# Altium project Kretsn_Brillz_4.PrjPcb
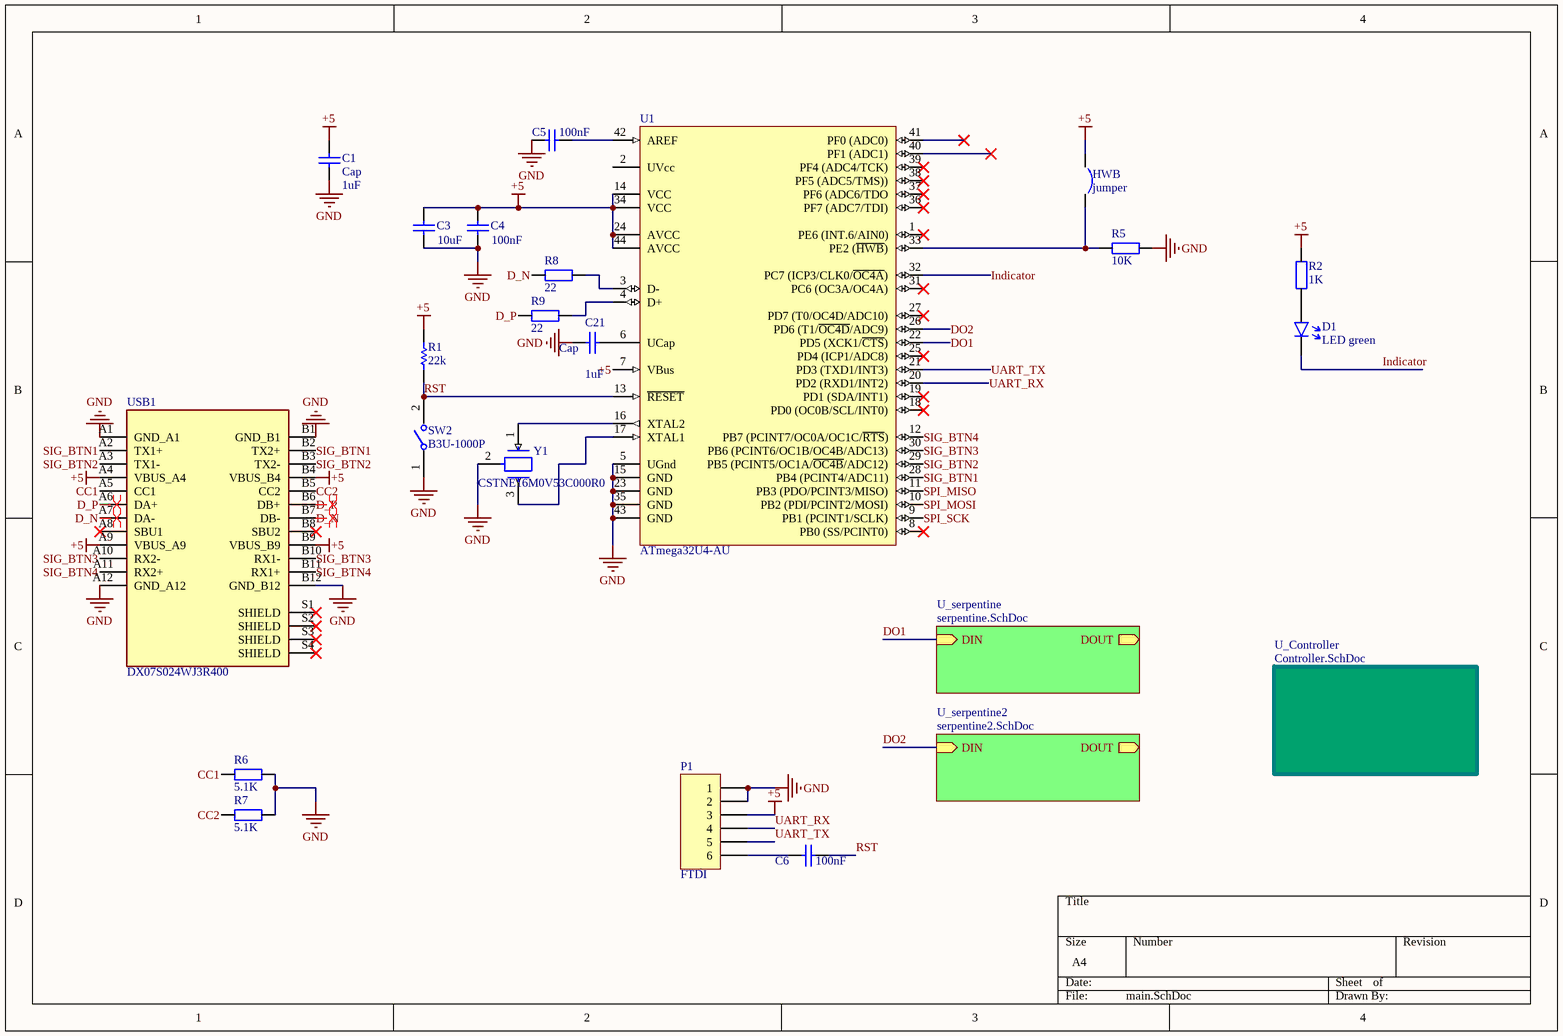
[diagram p0: main.SchDoc]
5 sheets, 142 parts. Net scope: hierarchical (ports join the sheet entries above them; power ports are global).
Board file: PCB1.PcbDoc
Sheets:
  main.SchDoc
    U_Controller = Controller.SchDoc
    U_serpentine = serpentine.SchDoc
      U_Column1 = Column.SchDoc
      U_Column2 = Column.SchDoc
      U_Column3 = Column.SchDoc
      U_Column4 = Column.SchDoc
      U_Column5 = Column.SchDoc
      U_Column6 = Column.SchDoc
      U_Column7 = Column.SchDoc
    U_serpentine2 = serpentine2.SchDoc
      U_Column8 = Column.SchDoc
      U_Column9 = Column.SchDoc
      U_Column10 = Column.SchDoc
      U_Column12 = Column.SchDoc
      U_Column13 = Column.SchDoc
      U_Column14 = Column.SchDoc
      U_Column15 = Column.SchDoc

## Sheet main.SchDoc
size A4; SheetNumber: 1; SheetTotal: 5

### Parts
C1  Cap  value 1uF  [6-0805_M]
C3  value 10uF  [6-0805_N]  (hidden comment: Cap)
C4  value 100nF  [6-0805_N]  (hidden comment: Cap)
C5  value 100nF  [6-0805_N]  (hidden comment: Cap)
C6  value 100nF  [6-0805_N]  (hidden comment: Cap)
C21  Cap  value 1uF  [6-0805_N]
D1  LED green  [LED0805]
HWB  jumper  [smd jumper]
P1  FTDI  [HDR1X6H]
R1  22k  [6-0805_N]
R2  1K  [RES0805]
R5  10K  [RES0805]
R6  5.1K  [RES0805]
R7  5.1K  [RES0805]
R8  22  [RES0805]
R9  22  [RES0805]
SW2  B3U-1000P  [FP-B3U-1000P-MFG]
U1  ATmega32U4-AU  [44ML_M]
USB1  DX07S024WJ3R400  [JAE_DX07S024WJ3R400]
Y1  CSTNE16M0V53C000R0  [FP-CSTNE16M0V53C000R0-MFG]

### Sub-sheets
U_Controller = Controller.SchDoc: no entries
U_serpentine = serpentine.SchDoc: DIN (in), DOUT (out)
U_serpentine2 = serpentine2.SchDoc: DIN (in), DOUT (out)

### Nets
+5: C1.1 C3.1 C4.1 HWB.1 P1.3 R1.2 R2.1 U1.7(VBus) U1.14(VCC) U1.24(AVCC) U1.34(VCC) U1.44(AVCC) USB1.A4(VBUS_A4) USB1.A9(VBUS_A9) USB1.B4(VBUS_B4) USB1.B9(VBUS_B9)
GND: C1.2 C3.2 C4.2 C5.2 C21.2 P1.1 P1.2 R5.2 R6.2 R7.2 SW2.1 U1.5(UGnd) U1.15(GND) U1.23(GND) U1.35(GND) U1.43(GND) USB1.A1(GND_A1) USB1.A12(GND_A12) USB1.B1(GND_B1) USB1.B12(GND_B12) Y1.2(GND)
CC1: R6.1 USB1.A5(CC1)
CC2: R7.1 USB1.B5(CC2)
D_N: R8.1 USB1.A7(DA-) USB1.B7(DB-)
D_P: R9.1 USB1.A6(DA+) USB1.B6(DB+)
DO1: U1.22(PD5_(XCK1/~{CTS})) ; sheet U_serpentine/DIN
DO2: U1.26(PD6_(T1/~{OC4D}/ADC9)) ; sheet U_serpentine2/DIN
Indicator: D1.2 U1.32(PC7_(ICP3/CLK0/~{OC4A}))
RST: C6.1 R1.1 SW2.2 U1.13(~{RESET})
SIG_BTN1: U1.28(PB4_(PCINT4/ADC11)) USB1.A2(TX1+) USB1.B2(TX2+)
SIG_BTN2: U1.29(PB5_(PCINT5/OC1A/~{OC4B}/ADC12)) USB1.A3(TX1-) USB1.B3(TX2-)
SIG_BTN3: U1.30(PB6_(PCINT6/OC1B/OC4B/ADC13)) USB1.A10(RX2-) USB1.B10(RX1-)
SIG_BTN4: U1.12(PB7_(PCINT7/OC0A/OC1C/~{RTS})) USB1.A11(RX2+) USB1.B11(RX1+)
SPI_MISO: U1.11(PB3_(PDO/PCINT3/MISO))
SPI_MOSI: U1.10(PB2_(PDI/PCINT2/MOSI))
SPI_SCK: U1.9(PB1_(PCINT1/SCLK))
UART_RX: P1.4 U1.20(PD2_(RXD1/INT2))
UART_TX: P1.5 U1.21(PD3_(TXD1/INT3))
NetC5_1: C5.1 U1.42(AREF)
NetC6_2: C6.2 P1.6
NetC21_1: C21.1 U1.6(UCap)
NetD1_1: D1.1(A) R2.2
NetHWB_2: HWB.2 R5.1 U1.33(PE2_(~{HWB}))
NetR8_2: R8.2 U1.3(D-)
NetR9_2: R9.2 U1.4(D+)
NetU1_16: U1.16(XTAL2) Y1.1(Input)
NetU1_17: U1.17(XTAL1) Y1.3(Output)

Not connected (* = marked no-connect by the designer): U1 1(PE6_(INT.6/AIN0))* 2(UVcc) 8(PB0_(SS/PCINT0))* 18(PD0_(OC0B/SCL/INT0))* 19(PD1_(SDA/INT1))* 25(PD4_(ICP1/ADC8))* 27(PD7_(T0/OC4D/ADC10))* 31(PC6_(OC3A/OC4A))* 36(PF7_(ADC7/TDI))* 37(PF6_(ADC6/TDO)* 38(PF5_(ADC5/TMS)))* 39(PF4_(ADC4/TCK))* 40(PF1_(ADC1))* 41(PF0_(ADC0))*; USB1 A8(SBU1)* B8(SBU2)* S1(SHIELD)* S2(SHIELD)* S3(SHIELD)* S4(SHIELD)*

### Layout directives
differential pair: D_N, D_P

### Library data of the parts
C1 = Cap: C107456; Published: 8-Jun-2000; LatestRevisionDate: 17-Jul-2002; LatestRevisionNote: Re-released for DXP Platform.; PackageReference: RAD-0.3; Publisher: Altium Limited; PackageDescription: Radial Cap, Thru-Hole; 2 Leads; 0.3 in Pin Spacing
C3 = Cap: C40894; Published: 8-Jun-2000; LatestRevisionDate: 17-Jul-2002; LatestRevisionNote: Re-released for DXP Platform.; PackageReference: RAD-0.3; Publisher: Altium Limited; PackageDescription: Radial Cap, Thru-Hole; 2 Leads; 0.3 in Pin Spacing
C4-C6 = Cap: C282730; Published: 8-Jun-2000; LatestRevisionDate: 17-Jul-2002; LatestRevisionNote: Re-released for DXP Platform.; PackageReference: RAD-0.3; Publisher: Altium Limited; PackageDescription: Radial Cap, Thru-Hole; 2 Leads; 0.3 in Pin Spacing
C21 = Cap: C393688; Published: 8-Jun-2000; LatestRevisionDate: 17-Jul-2002; LatestRevisionNote: Re-released for DXP Platform.; PackageReference: RAD-0.3; Publisher: Altium Limited; PackageDescription: Radial Cap, Thru-Hole; 2 Leads; 0.3 in Pin Spacing
D1 = LED single: C84260
P1 = Header 6H: Header, 6-Pin, Right Angle; LatestRevisionDate: 17-Jul-2002; LatestRevisionNote: Re-released for DXP Platform.; Publisher: Altium Limited
R1 = Res1: C269535; Published: 8-Jun-2000; LatestRevisionDate: 17-Jul-2002; LatestRevisionNote: Re-released for DXP Platform.; PackageReference: AXIAL-0.3; Publisher: Altium Limited; PackageDescription: Axial Device, Thru-Hole; 2 Leads; 0.3 in Pin Spacing; Value: 22k
R2 R5-R9 = Resistor: C269744
SW2 = CMP-2100-03586-2: SWITCH TACTILE SPST-NO 0.05A 12V; Contact Resistance: 100mR; Operating Force: 1.5N; Max Current Rating: 50mA; Switch Travel: 0.15mm; Actuator Type: Standard; Mechanical Life: 200000Cycles; Ratings: Dust Proof; Illumination Type: Non-Illuminated; Throw Configuration: SPST; Actuator Length: 0.4mm; Switch Function: Off-Mom; Height: 1.2mm; Width: 3mm; Weight: 0.000776oz; Contact Material: Silver; Max Voltage Rating (DC): 12V; Insulation Resistance: 100MR; Lead Free: Lead Free; Current Rating: 50mA; Termination: SMD/SMT; Length: 4mm; Voltage Rating (DC): 12V; Contact Current Rating: 50mA; Orientation: Straight; Depth: 2.5mm; Max Operating Temperature: 70°C; Packaging: Tape and Reel; Min Operating Temperature: -25°C; Package Quantity: 1; Mount: Surface Mount; Electrical Life: 200000Cycles
U1 = CMP-0095-00285-2: 8-bit AVR Microcontroller, 2.7-5.5V, 16MHz, 32KB Flash, 1KB EEPROM, 2.5KB SRAM, USB Controller, 44-pin TQFP, Industrial Grade (-40°C to 85°C), Ext Osc; RevisionNote: DatasheetVersion updated. URLs added.; ComponentLink1Description: Manufacturer URL; PackageDescription: 44-Pin Plastic Thin Quad Flat Pack, 10 x 10 x 1.0 mm Body, 0.8 mm Pitch (TQFP); DatasheetVersion: revF, Nov-2010; ComponentLink2URL: http://www.atmel.com/dyn/resources/prod_documents/doc7766.pdf; ComponentLink1URL: http://www.atmel.com/; PackageReference: 44ML; ComponentLink2Description: ATmega16U4/32U4 Datasheet; PackageVersion: rev.G, Jul-2007; ComponentLink3URL: http://www.atmel.com/dyn/resources/prod_documents/7766S.pdf; ComponentLink3Description: ATmega16U4 ATmega32U4 Summary
USB1 = DX07S024WJ3R400: Conn Rcpt Usb3.1 Typec Smd Vert; MF: {'manufacturer': u'JAE Electronics'}; Price: None; MP: DX07S024WJ3R400; Package: None; Value: *; Availability: Unavailable
Y1 = CMP-06057-000009-1: CERAMIC RES 16.0000MHZ 15PF SMD; Impedance: 40R; Frequency Stability: 0.15%; Frequency: 16MHz; Frequency Tolerance: 0.5%; Capacitance: 15pF; Resistor Type: Ceramic; Min Operating Temperature: -40°C; Case/Package: SMD/SMT; Packaging: Tape and Reel; Max Operating Temperature: 125°C; Mount: Surface Mount

## Sheet Controller.SchDoc
size A4; SheetNumber: 2; SheetTotal: 5
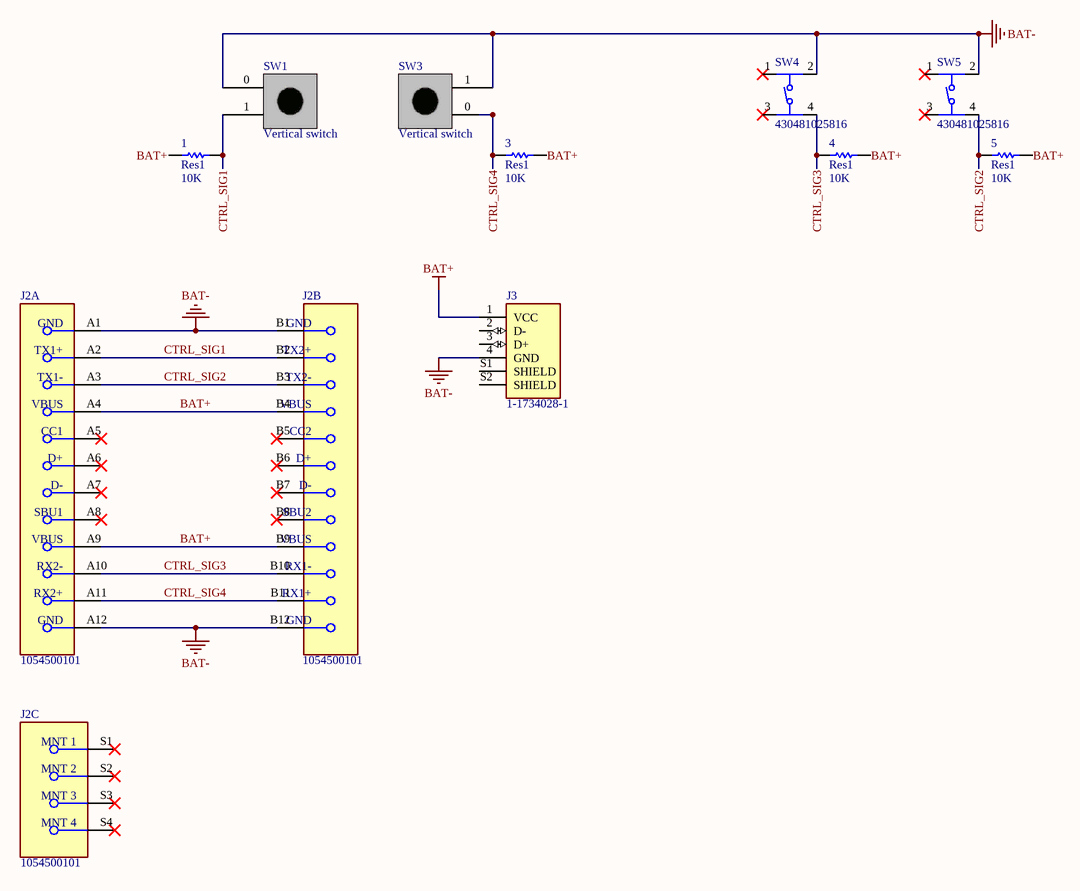
[diagram p1: Controller.SchDoc]

### Parts
1  Res1  value 10K  [6-0805_N]
3  Res1  value 10K  [6-0805_N]
4  Res1  value 10K  [6-0805_N]
5  Res1  value 10K  [6-0805_N]
J2  1054500101  [USB_C_Receptacle_Amphenol_12401548E4-2A]  (parts A,B,C of 3)
J3  1-1734028-1  [TE_1-1734028-1]
SW1  Vertical switch  [Btn_Vert]
SW3  Vertical switch  [Btn_Vert]
SW4  430481025816  [430481025816]
SW5  430481025816  [430481025816]

### Nets
BAT+: 1.2 3.1 4.1 5.1 J2.A4(VBUS) J2.A9(VBUS) J2.B4(VBUS) J2.B9(VBUS) J3.1(VCC)
BAT-: J2.A1(GND) J2.A12(GND) J2.B1(GND) J2.B12(GND) J3.4(GND) SW1.0 SW3.1 SW4.2 SW5.2
CTRL_SIG1: 1.1 J2.A2(TX1+) J2.B2(TX2+) SW1.1
CTRL_SIG2: 5.2 J2.A3(TX1-) J2.B3(TX2-) SW5.4
CTRL_SIG3: 4.2 J2.A10(RX2-) J2.B10(RX1-) SW4.4
CTRL_SIG4: 3.2 J2.A11(RX2+) J2.B11(RX1+) SW3.0

Not connected (* = marked no-connect by the designer): J2 A5(CC1)* A6(D+)* A7(D-)* A8(SBU1)* B5(CC2)* B6(D+)* B7(D-)* B8(SBU2)* S1(MNT_1)* S2(MNT_2)* S3(MNT_3)* S4(MNT_4)*; J3 2(D-) 3(D+) S1(SHIELD) S2(SHIELD); SW4 1* 3*; SW5 1* 3*

### Library data of the parts
1 3-5 = Res1: C269531; Published: 8-Jun-2000; LatestRevisionDate: 17-Jul-2002; LatestRevisionNote: Re-released for DXP Platform.; PackageReference: AXIAL-0.3; Publisher: Altium Limited; PackageDescription: Axial Device, Thru-Hole; 2 Leads; 0.3 in Pin Spacing
J2 = CMP-04767-000004-1: CONN RCP USB3.1 TYPEC 24P SMD RA; Manufacturer: Molex; Number Of Contacts: 24; Voltage Rating: 30V; Shielding: true; Is Female: yes; Current Rating: 0.25/1.25/5A; Pitch: 0.5mm; Conn Orientation: Right Angle; Package: 0; Height: 3.44mm; Footprint Url: https://www.molex.com/pdm_docs/sd/1054500101_sd.pdf; Device Class L1: Connectors; Category: Conn; Device Class L2: USB Connectors; Digikey Description: CONN RCP USB3.1 TYPEC 24P SMD RA; Contact Material: Gold,Nickel; Mouser Description: USB Shielded I/O Receptacle; Type C; Right Angle; Surface Mount; Gold over Nickel; ComponentLink2Description: Datasheet; Lead Free: Yes; Automotive: No; Temperature Range High: +85°C; RoHS: TRUE; Octopart: https://octopart.com/105450-0101-molex-68082325; ComponentLink2URL: https://www.molex.com/webdocs/datasheets/pdf/en-us/1054500101_IO_CONNECTORS.pdf; Temperature: -30°C to +85°C; Usb Standard: USB 3.1; Temperature Range Low: -30°C; Device Class L3: unset; Manufacturer Part Number: 1054500101
J3 = 1-1734028-1: Conn USB 2.0 Type A PL 4 POS Solder RA SMD 4 Terminal 1 Port T/R; MF: {'manufacturer': u'TE Connectivity'}; MP: 1-1734028-1; Package: None; Price: None; Value: *; Availability: Unavailable
SW1 SW3 = SWVERT: C294508
SW4 SW5 = 430481025816: <b>WS-TASV SMT Washable Tact Switch 6x6 mm  </B><BR><BR> <B>Material Properties</B> <BR> <BR>Cover Material : Stainless Steel <BR><BR> <B>Properties</B><BR> <BR>Actuator Material:LCP <BR>Actuator Flammability :UL94 V-0 <BR>Rating <BR>Actuator Color:Black; Salmon; White <BR>Contact Material:Stainless Steel <BR>Contact Plating:Silver <BR>Terminal Plating:Silver <BR>VR:12 V (DC) <BR>RISO:100 MÎ© <BR>Withstanding Voltage:250 V (AC) <BR>Washable:Yes <BR>Qty.:2000 <BR> <BR> <b>Mechanical Properties</b><BR> <BR>Stroke :0.25 mm<BR> <BR><b>General Information</b><br> <br>Operating Temperature:-40 up to +85 Â°C <BR>Washable:Yes <BR> <BR><b>Packaging Properties</b><br> <BR>Packaging:Tape and Reel  </b><br><BR>  <br><a href="https://www.we-online.com/catalog/media/o37542v209%20Family_WS-TASV_SMD_Tact_Switch_6x6mm_4304810xx8xx.jpg" title="Enlarge picture"> <img src="https://www.we-online.com/catalog/media/o37542v209%20Family_WS-TASV_SMD_Tact_Switch_6x6mm_4304810xx8xx.jpg"  width="320"></a><p>  Details see: <a href="https://www.we-online.com/catalog/en/TASV_6X6_SMD_WASHABLE/">https://www.we-online.com/catalog/en/TASV_6X6_SMD_WASHABLE/</a><p>  Updated by Ella Wu 2021-02-23 <br>2021(C) WÃ¼rth Elektronik; MF: {'manufacturer': u'Wurth Elektronik'}; MP: 430481025816; Price: None; Package: None; Availability: Unavailable; Value: *

## Sheet serpentine.SchDoc
size A4; SheetNumber: 3; SheetTotal: 5
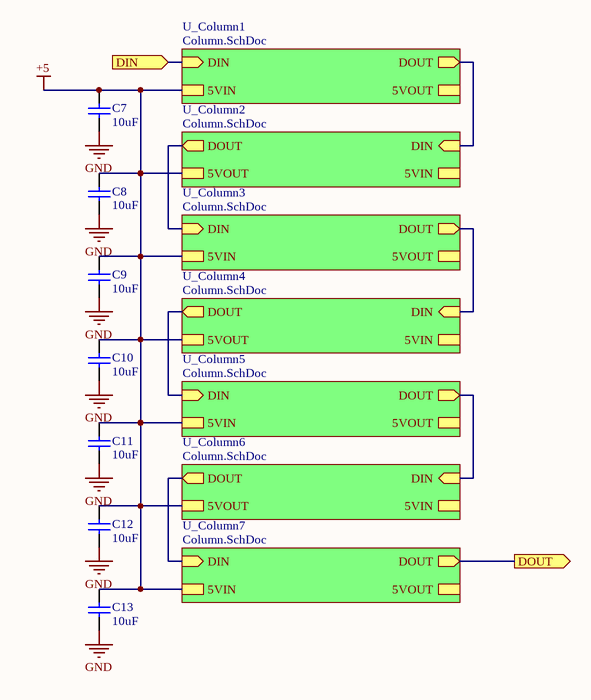
[diagram p2: serpentine.SchDoc]

### Parts
C7  10uF  [CAP1206]
C8  10uF  [CAP1206]
C9  10uF  [CAP1206]
C10  10uF  [CAP1206]
C11  10uF  [CAP1206]
C12  10uF  [CAP1206]
C13  10uF  [CAP1206]

### Sub-sheets
U_Column1 = Column.SchDoc: DIN (in), DOUT (out), 5VIN, 5VOUT
U_Column2 = Column.SchDoc: DIN (in), DOUT (out), 5VIN, 5VOUT
U_Column3 = Column.SchDoc: DIN (in), DOUT (out), 5VIN, 5VOUT
U_Column4 = Column.SchDoc: DIN (in), DOUT (out), 5VIN, 5VOUT
U_Column5 = Column.SchDoc: DIN (in), DOUT (out), 5VIN, 5VOUT
U_Column6 = Column.SchDoc: DIN (in), DOUT (out), 5VIN, 5VOUT
U_Column7 = Column.SchDoc: DIN (in), DOUT (out), 5VIN, 5VOUT

### Ports
DIN (in), DOUT (out)

### Nets
+5: C7.2 C8.2 C9.2 C10.2 C11.2 C12.2 C13.2 ; sheet U_Column1/5VIN, sheet U_Column1/5VOUT, sheet U_Column2/5VIN, sheet U_Column2/5VOUT, sheet U_Column3/5VIN, sheet U_Column3/5VOUT, sheet U_Column4/5VIN, sheet U_Column4/5VOUT, sheet U_Column5/5VIN, sheet U_Column5/5VOUT, sheet U_Column6/5VIN, sheet U_Column6/5VOUT, sheet U_Column7/5VIN, sheet U_Column7/5VOUT
GND: C7.1 C8.1 C9.1 C10.1 C11.1 C12.1 C13.1
DO1: port DIN, sheet U_Column1/DIN
NetLD1_U_Column2_4: sheet U_Column1/DOUT, sheet U_Column2/DIN
NetLD1_U_Column3_4: sheet U_Column2/DOUT, sheet U_Column3/DIN
NetLD1_U_Column4_4: sheet U_Column3/DOUT, sheet U_Column4/DIN
NetLD1_U_Column5_4: sheet U_Column4/DOUT, sheet U_Column5/DIN
NetLD1_U_Column6_4: sheet U_Column5/DOUT, sheet U_Column6/DIN
NetLD1_U_Column7_4: sheet U_Column6/DOUT, sheet U_Column7/DIN
NetLD7_U_Column7_2: port DOUT, sheet U_Column7/DOUT

### Library data of the parts
C7-C13 = CAP: C342827; Value: 1µF; Rated voltage: 25V; Tolerance: 10%; Manufacturer: *; Manufacturer P/N: *; Order code Farnell: 1288202RL; Power: *; Technology: X5R; Temperature  Factor: *; Temperature Max: +125°C; Temperature Min: -55°C; STS Code: *

## Sheet Column.SchDoc
size A4; SheetNumber: 4; SheetTotal: 5
Used 14 times, as channels U_serpentine/U_Column1, U_serpentine/U_Column2, U_serpentine/U_Column3, U_serpentine/U_Column4, U_serpentine/U_Column5, U_serpentine/U_Column6, U_serpentine/U_Column7, U_serpentine2/U_Column8, U_serpentine2/U_Column9, U_serpentine2/U_Column10, U_serpentine2/U_Column12, U_serpentine2/U_Column13, U_serpentine2/U_Column14, U_serpentine2/U_Column15. Parts and nets are listed once, with the designators drawn on the sheet.
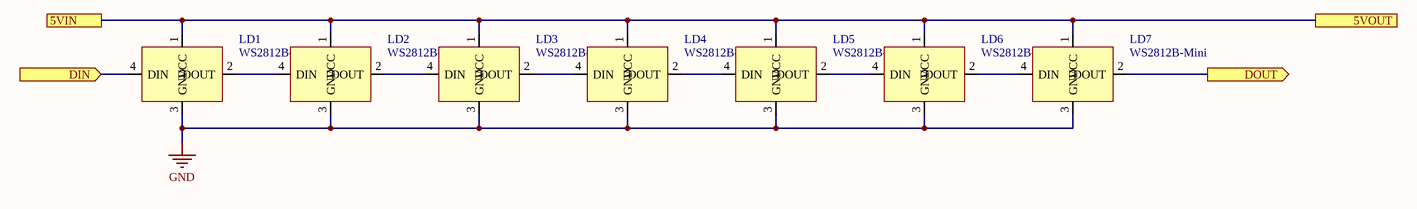
[diagram p3: Column.SchDoc]

### Parts
LD1  WS2812B-Mini  [WS2812B-Mini]
LD2  WS2812B-Mini  [WS2812B-Mini]
LD3  WS2812B-Mini  [WS2812B-Mini]
LD4  WS2812B-Mini  [WS2812B-Mini]
LD5  WS2812B-Mini  [WS2812B-Mini]
LD6  WS2812B-Mini  [WS2812B-Mini]
LD7  WS2812B-Mini  [WS2812B-Mini]

### Ports
5VIN, 5VOUT, DIN (in), DOUT (out)

### Nets
GND: LD1.3(GND) LD2.3(GND) LD3.3(GND) LD4.3(GND) LD5.3(GND) LD6.3(GND) LD7.3(GND)
5VIN: LD1.1(VCC) LD2.1(VCC) LD3.1(VCC) LD4.1(VCC) LD5.1(VCC) LD6.1(VCC) LD7.1(VCC) ; port 5VIN, port 5VOUT
DIN: LD1.4(DIN) ; port DIN
DOUT: LD7.2(DOUT) ; port DOUT
NetLD1_2: LD1.2(DOUT) LD2.4(DIN)
NetLD2_2: LD2.2(DOUT) LD3.4(DIN)
NetLD3_2: LD3.2(DOUT) LD4.4(DIN)
NetLD4_2: LD4.2(DOUT) LD5.4(DIN)
NetLD5_2: LD5.2(DOUT) LD6.4(DIN)
NetLD6_2: LD6.2(DOUT) LD7.4(DIN)

### Channels
U_serpentine/U_Column1: designators end in _U_Column1; ports 5VIN=+5 5VOUT=+5 DIN=DO1 DOUT=NetLD1_U_Column2_4
U_serpentine/U_Column2: designators end in _U_Column2; ports 5VIN=+5 5VOUT=+5 DIN=NetLD1_U_Column2_4 DOUT=NetLD1_U_Column3_4
U_serpentine/U_Column3: designators end in _U_Column3; ports 5VIN=+5 5VOUT=+5 DIN=NetLD1_U_Column3_4 DOUT=NetLD1_U_Column4_4
U_serpentine/U_Column4: designators end in _U_Column4; ports 5VIN=+5 5VOUT=+5 DIN=NetLD1_U_Column4_4 DOUT=NetLD1_U_Column5_4
U_serpentine/U_Column5: designators end in _U_Column5; ports 5VIN=+5 5VOUT=+5 DIN=NetLD1_U_Column5_4 DOUT=NetLD1_U_Column6_4
U_serpentine/U_Column6: designators end in _U_Column6; ports 5VIN=+5 5VOUT=+5 DIN=NetLD1_U_Column6_4 DOUT=NetLD1_U_Column7_4
U_serpentine/U_Column7: designators end in _U_Column7; ports 5VIN=+5 5VOUT=+5 DIN=NetLD1_U_Column7_4 DOUT=NetLD7_U_Column7_2
U_serpentine2/U_Column8: designators end in _U_Column8; ports 5VIN=+5 5VOUT=+5 DIN=DO2 DOUT=NetLD1_U_Column9_4
U_serpentine2/U_Column9: designators end in _U_Column9; ports 5VIN=+5 5VOUT=+5 DIN=NetLD1_U_Column9_4 DOUT=NetLD1_U_Column10_4
U_serpentine2/U_Column10: designators end in _U_Column10; ports 5VIN=+5 5VOUT=+5 DIN=NetLD1_U_Column10_4 DOUT=NetLD1_U_Column15_4
U_serpentine2/U_Column12: designators end in _U_Column12; ports 5VIN=+5 5VOUT=+5 DIN=NetLD1_U_Column12_4 DOUT=NetLD1_U_Column13_4
U_serpentine2/U_Column13: designators end in _U_Column13; ports 5VIN=+5 5VOUT=+5 DIN=NetLD1_U_Column13_4 DOUT=NetLD1_U_Column14_4
U_serpentine2/U_Column14: designators end in _U_Column14; ports 5VIN=+5 5VOUT=+5 DIN=NetLD1_U_Column14_4 DOUT=NetLD7_U_Column14_2
U_serpentine2/U_Column15: designators end in _U_Column15; ports 5VIN=+5 5VOUT=+5 DIN=NetLD1_U_Column15_4 DOUT=NetLD1_U_Column12_4

### Library data of the parts
LD1-LD7 = WS2812: C114583

## Sheet serpentine2.SchDoc
size A4; SheetNumber: 5; SheetTotal: 5
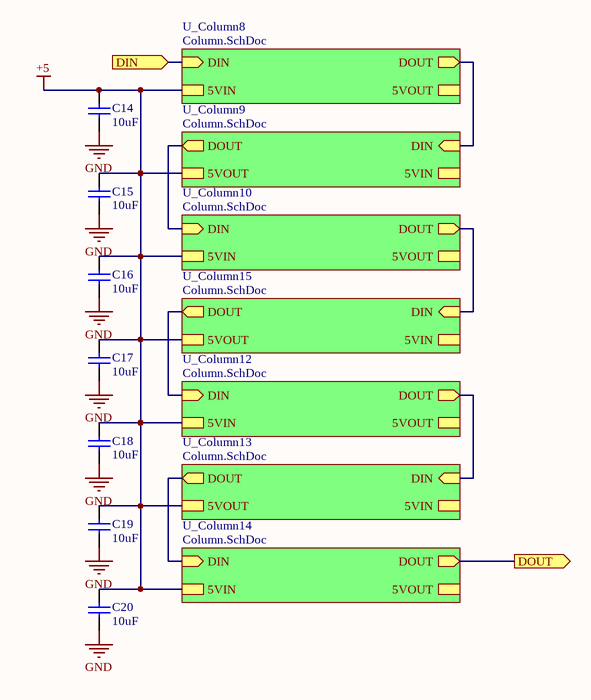
[diagram p4: serpentine2.SchDoc]

### Parts
C14  10uF  [CAP0603]
C15  10uF  [CAP1206]
C16  10uF  [CAP1206]
C17  10uF  [CAP1206]
C18  10uF  [CAP1206]
C19  10uF  [CAP1206]
C20  10uF  [CAP1206]

### Sub-sheets
U_Column8 = Column.SchDoc: DIN (in), DOUT (out), 5VIN, 5VOUT
U_Column9 = Column.SchDoc: DIN (in), DOUT (out), 5VIN, 5VOUT
U_Column10 = Column.SchDoc: DIN (in), DOUT (out), 5VIN, 5VOUT
U_Column12 = Column.SchDoc: DIN (in), DOUT (out), 5VIN, 5VOUT
U_Column13 = Column.SchDoc: DIN (in), DOUT (out), 5VIN, 5VOUT
U_Column14 = Column.SchDoc: DIN (in), DOUT (out), 5VIN, 5VOUT
U_Column15 = Column.SchDoc: DIN (in), DOUT (out), 5VIN, 5VOUT

### Ports
DIN (in), DOUT (out)

### Nets
+5: C14.2 C15.2 C16.2 C17.2 C18.2 C19.2 C20.2 ; sheet U_Column8/5VIN, sheet U_Column8/5VOUT, sheet U_Column9/5VIN, sheet U_Column9/5VOUT, sheet U_Column10/5VIN, sheet U_Column10/5VOUT, sheet U_Column12/5VIN, sheet U_Column12/5VOUT, sheet U_Column13/5VIN, sheet U_Column13/5VOUT, sheet U_Column14/5VIN, sheet U_Column14/5VOUT, sheet U_Column15/5VIN, sheet U_Column15/5VOUT
GND: C14.1 C15.1 C16.1 C17.1 C18.1 C19.1 C20.1
DO2: port DIN, sheet U_Column8/DIN
NetLD1_U_Column9_4: sheet U_Column8/DOUT, sheet U_Column9/DIN
NetLD1_U_Column10_4: sheet U_Column9/DOUT, sheet U_Column10/DIN
NetLD1_U_Column12_4: sheet U_Column12/DIN, sheet U_Column15/DOUT
NetLD1_U_Column13_4: sheet U_Column12/DOUT, sheet U_Column13/DIN
NetLD1_U_Column14_4: sheet U_Column13/DOUT, sheet U_Column14/DIN
NetLD1_U_Column15_4: sheet U_Column10/DOUT, sheet U_Column15/DIN
NetLD7_U_Column14_2: port DOUT, sheet U_Column14/DOUT

### Library data of the parts
C14-C20 = CAP: as C7 on sheet serpentine; Manufacturer: *; Manufacturer P/N: *; Order code Farnell: 1288202RL; Power: *; Technology: X5R; Temperature  Factor: *; Temperature Max: +125°C; Temperature Min: -55°C; STS Code: *

## Nets that join several sheets
+5: main (16 pins), serpentine (7 pins), U_serpentine/U_Column1 (7 pins), U_serpentine/U_Column2 (7 pins), U_serpentine/U_Column3 (7 pins), U_serpentine/U_Column4 (7 pins), U_serpentine/U_Column5 (7 pins), U_serpentine/U_Column6 (7 pins), U_serpentine/U_Column7 (7 pins), serpentine2 (7 pins), U_serpentine2/U_Column8 (7 pins), U_serpentine2/U_Column9 (7 pins), U_serpentine2/U_Column10 (7 pins), U_serpentine2/U_Column12 (7 pins), U_serpentine2/U_Column13 (7 pins), U_serpentine2/U_Column14 (7 pins), U_serpentine2/U_Column15 (7 pins)
GND: main (21 pins), serpentine (7 pins), U_serpentine/U_Column1 (7 pins), U_serpentine/U_Column2 (7 pins), U_serpentine/U_Column3 (7 pins), U_serpentine/U_Column4 (7 pins), U_serpentine/U_Column5 (7 pins), U_serpentine/U_Column6 (7 pins), U_serpentine/U_Column7 (7 pins), serpentine2 (7 pins), U_serpentine2/U_Column8 (7 pins), U_serpentine2/U_Column9 (7 pins), U_serpentine2/U_Column10 (7 pins), U_serpentine2/U_Column12 (7 pins), U_serpentine2/U_Column13 (7 pins), U_serpentine2/U_Column14 (7 pins), U_serpentine2/U_Column15 (7 pins)
DO1: main (U1.22), U_serpentine/U_Column1 (LD1_U_Column1.4)
DO2: main (U1.26), U_serpentine2/U_Column8 (LD1_U_Column8.4)
NetLD1_U_Column2_4: U_serpentine/U_Column1 (LD7_U_Column1.2), U_serpentine/U_Column2 (LD1_U_Column2.4)
NetLD1_U_Column3_4: U_serpentine/U_Column2 (LD7_U_Column2.2), U_serpentine/U_Column3 (LD1_U_Column3.4)
NetLD1_U_Column4_4: U_serpentine/U_Column3 (LD7_U_Column3.2), U_serpentine/U_Column4 (LD1_U_Column4.4)
NetLD1_U_Column5_4: U_serpentine/U_Column4 (LD7_U_Column4.2), U_serpentine/U_Column5 (LD1_U_Column5.4)
NetLD1_U_Column6_4: U_serpentine/U_Column5 (LD7_U_Column5.2), U_serpentine/U_Column6 (LD1_U_Column6.4)
NetLD1_U_Column7_4: U_serpentine/U_Column6 (LD7_U_Column6.2), U_serpentine/U_Column7 (LD1_U_Column7.4)
NetLD1_U_Column9_4: U_serpentine2/U_Column8 (LD7_U_Column8.2), U_serpentine2/U_Column9 (LD1_U_Column9.4)
NetLD1_U_Column10_4: U_serpentine2/U_Column9 (LD7_U_Column9.2), U_serpentine2/U_Column10 (LD1_U_Column10.4)
NetLD1_U_Column12_4: U_serpentine2/U_Column12 (LD1_U_Column12.4), U_serpentine2/U_Column15 (LD7_U_Column15.2)
NetLD1_U_Column13_4: U_serpentine2/U_Column12 (LD7_U_Column12.2), U_serpentine2/U_Column13 (LD1_U_Column13.4)
NetLD1_U_Column14_4: U_serpentine2/U_Column13 (LD7_U_Column13.2), U_serpentine2/U_Column14 (LD1_U_Column14.4)
NetLD1_U_Column15_4: U_serpentine2/U_Column10 (LD7_U_Column10.2), U_serpentine2/U_Column15 (LD1_U_Column15.4)